# Altium project ws2812esp32_v1.0.PrjPcb
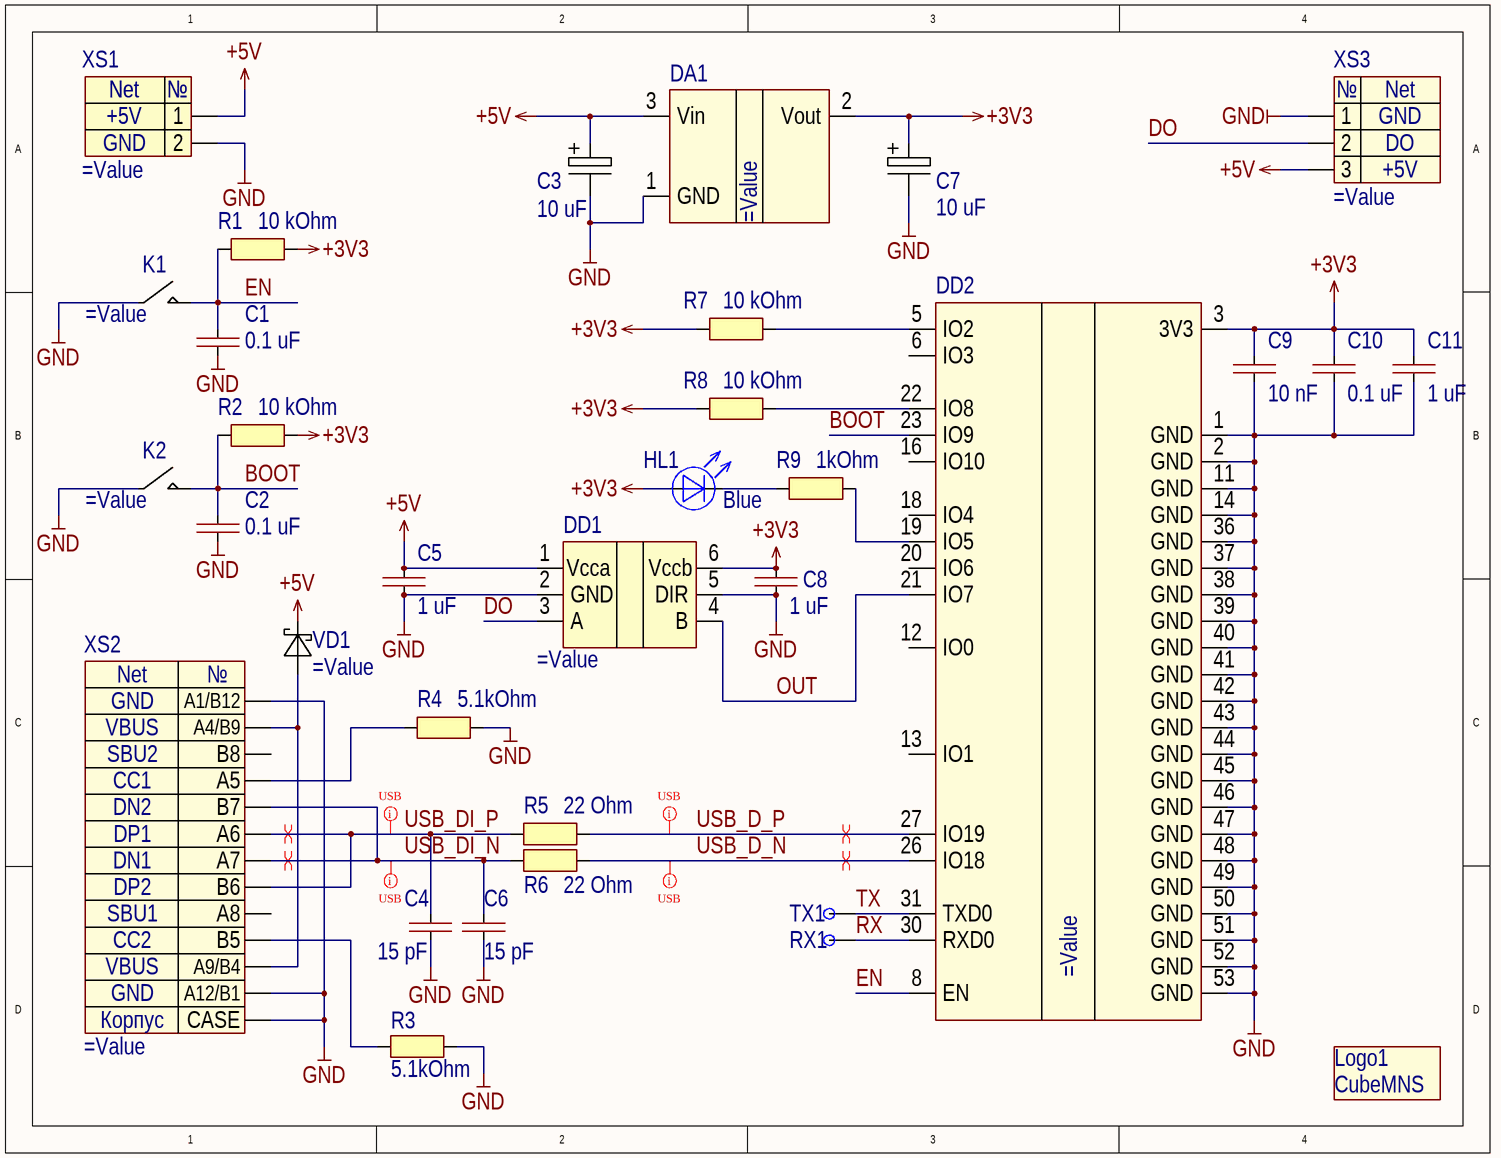
[diagram p0: ws2812esp32_v1.0.SchDoc]
1 sheet, 33 parts. Net scope: global (net labels, ports and power ports of the same name join across sheets).
Board file: ws2812esp32_v1.0.PcbDoc

## Sheet ws2812esp32_v1.0.SchDoc: WS2812B ESP32-S3
size Letter; Date: 2; ApprovedBy: 3; CheckedBy: 4; Author: 5; CompanyName: 6; DrawnBy: Nikita; Engineer: 7; Organization: 8; Address1: 9; Address2: 10; Address3: 11; Address4: 12; DocumentNumber: 13; Revision: 14; SheetNumber: 1; SheetTotal: 1; Time: 1; ImagePath: 15; Application_BuildNumber: 16

### Parts
C1  0.1 uF  [C0402]
C2  0.1 uF  [C0402]
C3  10 uF  [C tantalin Type A]
C4  15 pF  [C0402]
C5  1 uF  [C0402]
C6  15 pF  [C0402]
C7  10 uF  [C tantalin Type A]
C8  1 uF  [C0402]
C9  10 nF  [C0402]
C10  0.1 uF  [C0402]
C11  1 uF  [C0402]
DA1  (no value)  [SOT223]
DD1  (no value)  [SC-70-6]
DD2  (no value)  [ESP32-C3-MINI-1]
HL1  Blue  [LED0603]
K1  (no value)  [B3U-1000P-B]
K2  (no value)  [B3U-1000P-B]
Logo1  CubeMNS  [CubeMNS]  (no BOM)
R1  10 kOhm  [R0402]
R2  10 kOhm  [R0402]
R3  5.1kOhm  [R0402]
R4  5.1kOhm  [R0402]
R5  22 Ohm  [R0402]
R6  22 Ohm  [R0402]
R7  10 kOhm  [R0402]
R8  10 kOhm  [R0402]
R9  1kOhm  [R0402]
RX1  (no value)  [СontactPad0.5]  (no BOM)
TX1  (no value)  [СontactPad0.5]  (no BOM)
VD1  (no value)  [SOD-123F]
XS1  (no value)  [FLTS22WR00]
XS2  (no value)  [USB4110-GF-A]
XS3  (no value)  [FLTS32WR00]

### Nets
+3V3: C7.1(+) C8.2 C9.2 C10.2 C11.2 DA1.2(Vout) DD1.6(Vccb) DD2.3(3V3) HL1.2(+) R1.1 R2.1 R7.2 R8.2
+5V: C3.1(+) C5.2 DA1.3(Vin) DD1.1(Vcca) VD1.1(-) XS1.1 XS3.3
GND: C1.1 C2.1 C3.2(-) C4.1 C5.1 C6.1 C7.2(-) C8.1 C9.1 C10.1 C11.1 DA1.1(GND) DD1.2(GND) DD1.5(DIR) DD2.1(GND) DD2.2(GND) DD2.11(GND) DD2.14(GND) DD2.36(GND) DD2.37(GND) DD2.38(GND) DD2.39(GND) DD2.40(GND) DD2.41(GND) DD2.42(GND) DD2.43(GND) DD2.44(GND) DD2.45(GND) DD2.46(GND) DD2.47(GND) DD2.48(GND) DD2.49(GND) DD2.50(GND) DD2.51(GND) DD2.52(GND) DD2.53(GND) K1.1 K2.1 R3.2 R4.2 XS1.2 XS2.0(CASE) XS2.A1/B12 XS2.A12/B1 XS3.1
BOOT: C2.2 DD2.23(IO9) K2.2 R2.2
DO: DD1.3(A) XS3.2
EN: C1.2 DD2.8(EN) K1.2 R1.2
OUT: DD1.4(B) DD2.21(IO7)
RX: DD2.30(RXD0) RX1.1
TX: DD2.31(TXD0) TX1.1
USB_D_N: DD2.26(IO18) R6.2
USB_D_P: DD2.27(IO19) R5.2
USB_DI_N: C6.2 R6.1 XS2.A7 XS2.B7
USB_DI_P: C4.2 R5.1 XS2.A6 XS2.B6
NetDD2_5: DD2.5(IO2) R7.1
NetDD2_19: DD2.19(IO5) R9.2
NetDD2_22: DD2.22(IO8) R8.1
NetHL1_1: HL1.1(-) R9.1
NetR3_1: R3.1 XS2.B5
NetR4_1: R4.1 XS2.A5
NetVD1_2: VD1.2(+) XS2.A4/B9 XS2.A9/B4

Not connected (* = marked no-connect by the designer): DD2 6(IO3) 12(IO0) 13(IO1) 16(IO10) 18(IO4) 20(IO6); XS2 A8 B8

### Layout directives
differential pair: USB_D_N, USB_D_P, USB_DI_N, USB_DI_P
net class USB: USB_D_N, USB_D_P, USB_DI_N, USB_DI_P

### Notes on the sheet
- (near XS1) +5V
- (near XS1) GND
- (near XS3) +5V
- (near XS3) GND
- DO
- Перв. примен.
- Справ. номер
- Подп. и дата
- Инв.№ дубл.
- Взам. инв.№
- Разраб.
- Изм
- Лист
- № докум.
- Подп.
- Дата
- Лит.
- Масса
- Масштаб
- Пров.
- Т.контр.
- Листов
- Инв.№ подл.
- Н.контр.
- Утв.
- Согл.
- Формат
- А3
- (in symbol FLTS22WR00) Net; №
- (in symbol FLTS32WR00) №; Net
- (in symbol USB4110-GF-A) Net; №; GND; VBUS; SBU2; CC1; DN2; DP1; DN1; DP2; SBU1; CC2; Корпус

### Library data of the parts
C1 C2 C10 = C0402 0.1uF 10% 25V: CAP CER 0.1UF 50V X7R 0402; Part Number: GRM155R71H104KE14D; Manufacture: Murata; Tolerance: 10; Ohm/H/F: 0.0000001; Seller: DigiKey; Analog: *; Value: 0.1 uF; Case Type: SMD; Case: 0402; Current: *; Voltage: 50V; Watt: *; Temperature min: -40; Temperature max: +85; Seller Link: https://www.digikey.com/en/products/detail/murata-electronics/GRM155R71H104KE14D/4906220
C3 C7 = C tantalum type A 10uF: CAP TANT 10UF 10% 10V 1206; Part Number: T491A106K010AT; Manufacture: Kemet; Analog: XiangJiang CA45A010K106TA; Ohm/H/F: 0.000010; Seller: DigiKey; Value: 10 uF; Tolerance: 10%; Case Type: SMD; Case: Molded A; Current: *; Voltage: 10V; Watt: *; Temperature min: -40; Temperature max: +85; Seller Link: https://www.digikey.com/en/products/detail/kemet/T491A106K010AT/818545
C4 C6 = C0402 15pF 5% 25V: CAP CER 15PF 50V C0G/NP0 0402; Part Number: GRM1555C1H150JA01D; Manufacture: Murata; Tolerance: 5; Ohm/H/F: 0.000000000015; Seller: DigiKey; Analog: *; Value: 15 pF; Case Type: SMD; Case: 0402; Current: *; Voltage: 50V; Watt: *; Temperature min: -40; Temperature max: +85; Seller Link: https://www.digikey.com/en/products/detail/murata-electronics/GRM1555C1H150JA01D/2791374
C5 C8 C11 = C0402 1uF 10% 25V: CAP CER 1UF 25V X5R 0402; Part Number: GRM155R61E105KA12D; Manufacture: Murata; Seller: DigiKey; Analog: *; Value: 1 uF; Tolerance: *; Ohm/H/F: *; Case Type: SMD; Case: 0402; Current: *; Voltage: 25V; Watt: *; Temperature min: -40; Temperature max: +85; Seller Link: https://www.digikey.com/en/products/detail/murata-electronics/GRM155R61E105KA12D/4905139
C9 = C0402 10nF 10% 25V: CAP CER 10000PF 25V X7R 0402; Part Number: GRM155R71E103KA01D; Manufacture: Murata; Tolerance: 10%; Ohm/H/F: 0.00000001; Seller: DigiKey; Analog: *; Value: 10 nF; Case Type: SMD; Case: 0402; Current: *; Voltage: 25V; Watt: *; Temperature min: -40; Temperature max: +85; Seller Link: https://www.digikey.com/en/products/detail/murata-electronics/GRM155R71E103KA01D/587223
DA1 = LM1117GS-3.3: IC REG LINEAR 3.3V 1A SOT223-3; Manufacture: Taejin; Analog: ST LDL1117S33R, TI LM1117MP-3.3; Voltage: +3.3V; Seller: DigiKey; Part Number: LM1117GS-3.3; Value: LM1117GS-3.3; Tolerance: *; Ohm/H/F: *; Case Type: SMD; Case: SOT-223; Current: 1 A; Watt: *; Temperature min: -40; Temperature max: +85; Seller Link: https://www.digikey.com/en/products/detail/taejin/LM1117GS-3-3/22237426?s=N4IgTCBcDaIDIFkCMKDsBxAygWgMwDpcQBdAXyA
DD1 = SN74LVC1T45DCK: IC TRANSLTR BIDIRECTIONAL SC70-6; Manufacture: TI; Voltage: +5.5V; Seller: DigiKey; Part Number: SN74LVC1T45DCK; Analog: *; Value: SN74LVC1T45DCK; Tolerance: *; Ohm/H/F: *; Case Type: SMD; Case: SC70 DCK; Current: *; Watt: *; Temperature min: -40; Temperature max: +85; Seller Link: https://www.digikey.com/en/products/detail/texas-instruments/SN74LVC1T45DCKR/639456
DD2 = ESP32-C3-MINI-1: RF TXRX MODULE BT PCB TRACE SMD; Manufacture: Espressif; Current: 350 mA; Voltage: +3.3V; Seller: DigiKey; Part Number: ESP32-C3-MINI-1; Analog: *; Value: ESP32-C3-MINI-1; Tolerance: *; Ohm/H/F: *; Case Type: SMD; Case: SMD Module 13.2 x 12.5 x 2.4; Watt: *; Temperature min: -40; Temperature max: +85; Seller Link: https://www.digikey.com/en/products/detail/espressif-systems/ESP32-C3-MINI-1-H4/14548892
HL1 = LED 0603 Blue: Part Number: APT1608QBC/D; Manufacture: Kingbright; Current: 20mA; Voltage: 4V; Seller: DigiKey; Analog: *; Value: Blue; Tolerance: *; Ohm/H/F: *; Case Type: SMD; Case: 0603; Watt: *; Temperature min: -40; Temperature max: +85; Seller Link: https://www.digikey.com/en/products/detail/kingbright/APT1608QBC-D/2163697
K1 K2 = B3U-1000P-B: SWITCH TACTILE SPST-NO 0.05A 12V; Manufacture: Omron; Seller: DigiKey; Part Number: B3U-1000P-B; Value: B3U-1000P-B; Tolerance: *; Ohm/H/F: *; Case Type: SMD; Case: 3.0 x 2.5 x 1.85; Current: *; Voltage: *; Watt: *; Temperature min: -40; Temperature max: +85; Seller Link: https://www.digikey.com/en/products/detail/omron-electronics-inc-emc-div/B3U-1000P-B/1811777?s=N4IgTCBcDaIEIGYCqBaAjABiwBRXEAugL5A
R1 R2 R7 R8 = R0402 10kOhm 1%: RES 10K OHM 1/16W 1% 0402 SMD; Part Number: RC0402FR-0710KL; Manufacture: Yageo; Ohm/H/F: 10000; Watt: 0.063; Seller: DigiKey; Analog: *; Value: 10 kOhm; Tolerance: 1%; Case Type: SMD; Case: 0402; Current: *; Voltage: *; Temperature min: -40; Temperature max: +85; Seller Link: https://www.digikey.com/en/products/detail/yageo/RC0402FR-0710KL/726523
R3 R4 = R0402 5.1kOhm 1%: RES 5.1K OHM 1/16W 1% 0402 SMD; Part Number: RC0402FR-075K1L; Manufacture: Yageo; Ohm/H/F: 5100; Watt: 0.063; Seller: DigiKey; Analog: *; Value: 5.1kOhm; Tolerance: 1%; Case Type: SMD; Case: 0402; Current: *; Voltage: *; Temperature min: -40; Temperature max: +85; Seller Link: https://www.digikey.com/en/products/detail/yageo/RC0402FR-075K1L/726624
R5 R6 = R0402 22Ohm 1%: RES 22 OHM 1/16W 1% 0402 SMD; Part Number: RC0402FR-0722RL; Manufacture: Yageo; Ohm/H/F: 22; Watt: 0.063; Seller: DigiKey; Analog: *; Value: 22 Ohm; Tolerance: 1%; Case Type: SMD; Case: 0402; Current: *; Voltage: *; Temperature min: -40; Temperature max: +85; Seller Link: https://www.digikey.com/en/products/detail/yageo/RC0402FR-0722RL/726562
R9 = R0402 1kOhm 1%: RES 1K OHM 1/16W 1% 0402 SMD; Part Number: RC0402FR-071KL; Manufacture: Yageo; Ohm/H/F: 1000; Watt: 0.063; Seller: DigiKey; Analog: *; Value: 1kOhm; Tolerance: 1%; Case Type: SMD; Case: 0402; Current: *; Voltage: *; Temperature min: -40; Temperature max: +85; Seller Link: https://www.digikey.com/en/products/detail/yageo/RC0402FR-071KL/726513
RX1 TX1 = Сontact Pad: Round 0.5 mm; Part Number: *; Manufacture: *; Analog: *; Value: *; Tolerance: *; Ohm/H/F: *; Case Type: SMD; Case: D0.5; Current: *; Voltage: *; Watt: *; Temperature min: -40; Temperature max: +85; Seller: *; Seller Link: *
VD1 = DSK14: DIODE SCHOTTKY 40V 1A; Manufacture: MDD; Value: DSK14; Seller: DigiKey; Part Number: DSK14; Analog: *; Tolerance: *; Ohm/H/F: *; Case Type: SMD; Case: SOD-123FL; Current: 1A; Voltage: 40V; Watt: *; Temperature min: -55; Temperature max: +150; Seller Link: https://www.digikey.com/en/products/detail/nextgen-components/DSK14/14291074
XS1 = FLTS22WR00: SMD TERMINAL BLOCK 2 PIN; Manufacture: Amphenol; Analog: WAGO 2060-472/998-404; Current: 7A; Voltage: 250V; Seller: DigiKey; Part Number: FLTS22WR00; Value: FLTS22WR00; Tolerance: *; Ohm/H/F: *; Case Type: SMD; Case: 7.9 x 13.1 x 4.6; Watt: *; Temperature min: -40; Temperature max: +105; Seller Link: https://www.digikey.com/en/products/detail/amphenol-cs-commercial-products/FLTS22WR00/20422799
XS2 = USB4110-GF-A: CONN RCP USB2.0 TYP C 24P SMD RA; Manufacture: GCT; Analog: Amphenol GSB1C41110SSHR; Current: 5A; Voltage: 48V; Seller: DigiKey; Part Number: USB4110-GF-A; Value: USB4110-GF-A; Tolerance: *; Ohm/H/F: *; Case Type: SMD; Case: USB2.0 TYP C 24P SMD RA; Watt: *; Temperature min: -40; Temperature max: +85; Seller Link: https://www.digikey.com/en/products/detail/gct/USB4110-GF-A/10384547
XS3 = FLTS32WR00: SMD TERMINAL BLOCK 3 PIN; Manufacture: Amphenol; Analog: WAGO 2060-473/998-404; Current: 7A; Voltage: 250V; Seller: DigiKey; Part Number: FLTS32WR00; Value: FLTS32WR00; Tolerance: *; Ohm/H/F: *; Case Type: SMD; Case: 11.9 x 13.1 x 4.6; Watt: *; Temperature min: -40; Temperature max: +105; Seller Link: https://www.digikey.com/en/products/detail/amphenol-cs-commercial-products/FLTS32WR00/20426575